# Altium project BALANCE.PrjPcb
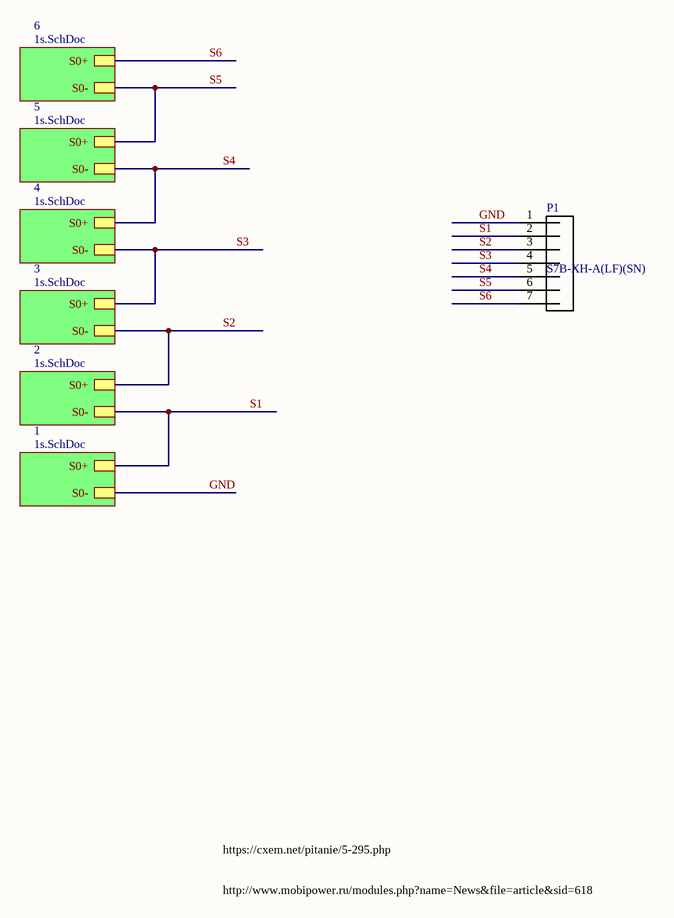
[diagram p0: Sheet2.SchDoc]
2 sheets, 61 parts. Net scope: hierarchical (ports join the sheet entries above them; power ports are global).
Board file: balance.PcbDoc
Sheets:
  Sheet2.SchDoc
    1 = 1s.SchDoc
    2 = 1s.SchDoc
    3 = 1s.SchDoc
    4 = 1s.SchDoc
    5 = 1s.SchDoc
    6 = 1s.SchDoc

## Sheet Sheet2.SchDoc
size A3 portrait

### Parts
P1  S7B-XH-A(LF)(SN)  [*JST_S7B-XH-A(LF)(SN)]

### Sub-sheets
1 = 1s.SchDoc: S0-, S0+
2 = 1s.SchDoc: S0-, S0+
3 = 1s.SchDoc: S0-, S0+
4 = 1s.SchDoc: S0-, S0+
5 = 1s.SchDoc: S0-, S0+
6 = 1s.SchDoc: S0-, S0+

### Nets
GND: P1.1 ; sheet 1/S0-
S1: P1.2 ; sheet 1/S0+, sheet 2/S0-
S2: P1.3 ; sheet 2/S0+, sheet 3/S0-
S3: P1.4 ; sheet 3/S0+, sheet 4/S0-
S4: P1.5 ; sheet 4/S0+, sheet 5/S0-
S5: P1.6 ; sheet 5/S0+, sheet 6/S0-
S6: P1.7 ; sheet 6/S0+

### Notes on the sheet
- https://cxem.net/pitanie/5-295.php
- http://www.mobipower.ru/modules.php?name=News&file=article&sid=618
- Title
- Size:
- Date:
- A3
- Number:
- Time:
- Revision:
- Sheet
- of
- File:

### Library data of the parts
P1 = S7B-XH-A(LF)(SN): XH Series 7 Position 2.5 mm Through Hole Right Angle Press Fit Shrouded Header; MP: S4B-XH-A_LF__SN_; MF: JST Sales; Package: None; SnapEDA_Link: https://www.snapeda.com/parts/S4B-XH-A%28LF%29%28SN%29/JST%20Sales%20America%20Inc./view-part/?ref=snap; Availability: Unavailable; Price: None; Value: *

## Sheet 1s.SchDoc
size A3 portrait
Used 6 times, as channels 1, 2, 3, 4, 5, 6. Parts and nets are listed once, with the designators drawn on the sheet.
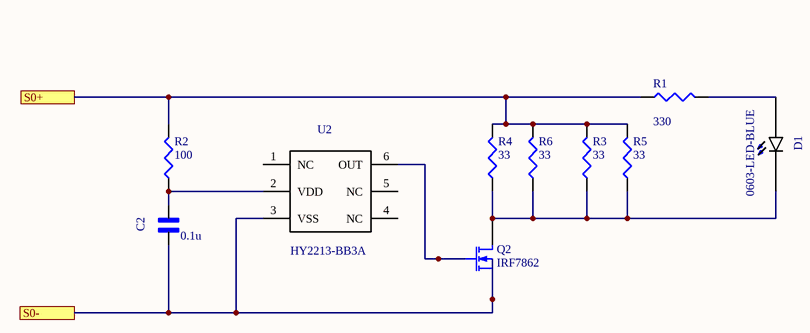
[diagram p1: 1s.SchDoc]

### Parts
C2  value 0.1u  [*CAPC1608X90]  (hidden comment: GX035C104MAT2-500)
D1  0603-LED-BLUE  [*LEDM1608X80_LTE-C1906R-14(Primary)]
Q2  IRF7862  [*SO-08]
R1  value 330  [J1-0603]  (hidden comment: RC0603FR-07330RL)
R2  value 100  [J1-0603]  (hidden comment: Res3)
R3  value 33  [12Z-2010]  (hidden comment: Res3)
R4  value 33  [12Z-2010]  (hidden comment: Res3)
R5  value 33  [12Z-2010]  (hidden comment: Res3)
R6  value 33  [12Z-2010]  (hidden comment: Res3)
U2  HY2213-BB3A  [sot23-6]

### Ports
S0+, S0-

### Nets
S0+: R1.1 R2.2 R3.2 R4.2 R5.2 R6.2 ; port S0+
S0-: C2.2 Q2.S U2.3(VSS) ; port S0-
NetC2_1: C2.1 R2.1 U2.2(VDD)
NetD1_A: D1.A R1.2
NetD1_C: D1.C Q2.D R3.1 R4.1 R5.1 R6.1
NetQ2_G: Q2.G U2.6(OUT)

Not connected (* = marked no-connect by the designer): U2 1(NC) 4(NC) 5(NC)

### Channels
1: designators end in _1; ports S0+=S1 S0-=GND
2: designators end in _2; ports S0+=S2 S0-=S1
3: designators end in _3; ports S0+=S3 S0-=S2
4: designators end in _4; ports S0+=S4 S0-=S3
5: designators end in _5; ports S0+=S5 S0-=S4
6: designators end in _6; ports S0+=S6 S0-=S5

### Notes on the sheet
- Title
- Size:
- Date:
- A3
- Number:
- Time:
- Revision:
- Sheet
- of
- File:

### Library data of the parts
C2 = GX035C104MAT2-500: Cap Thin Film 0.1uf 50v 0603; MF: AVX; MP: GX035C104MAT2-500 or CL10B104JB8NNNC; Pacage Metric: 1608; Type: SMD; Package: 0603 AVX; SnapEDA_Link: https://www.snapeda.com/parts/GX035C104MAT2-500/AVX/view-part/?ref=snap
D1 = LTE-C1906R-14: LED IrLED Chip LED 2-Pin SMD T/R; Package: 0603 Lite-On; MP: 0603-LED-BLUE; SnapEDA_Link: https://www.snapeda.com/parts/LTE-C1906R-14/Lite-On%20Inc./view-part/?ref=snap; Value: *; Type: SMD
Q2 = IRF7862: N-Channel MOSFET; Published: 8-Jun-2000; LatestRevisionDate: 17-Jul-2002; LatestRevisionNote: Re-released for DXP Platform.; PackageVersion: 1995/1996; PackageReference: E3; Publisher: Altium Limited; PackageDescription: TO, Flat Index; 3 In-Line, Axial Leads; Body Dia. 4.6mm; Lead Dia. 0.5 mm (max)
R1 = RC0603FR-07330RL: 330 Ohms ±1% 0.1W, 1/10W Chip Resistor 0603 (1608 Metric) Thick Film; Pacage Metric: 1608; MF: Yageo or NXP; ChipDip_Link: https://www.chipdip.ru/product0/9000079628; HelpURL: https://www.yageo.com/upload/media/product/productsearch/datasheet/rchip/PYu-RC_Group_51_RoHS_L_10.pdf; Package: R0603; Type: SMD; MP: RC0603FR-07330RL; SnapEDA_Link: https://www.snapeda.com/parts/RC0603FR-07330RL/Yageo/view-part/?ref=search&t=RC0603FR-07330RL
R2-R6 = Res3: Resistor; Published: 8-Jun-2000; LatestRevisionDate: 29-May-2009; LatestRevisionNote: IPC-7351 Footprint Added.; PackageReference: J1-0603; Publisher: Altium Limited; PackageDescription: Chip Resistor
U2 = HY2213-BB3A: MF: infineon; MP: IRS10752LTRPBF; Availability: Unavailable; Package: SOT-23-6; Price: None; SnapEDA_Link: https://www.snapeda.com/parts/IRS10752LTRPBF/Infineon%20Technologies/view-part/?ref=search&t=IRS10752; Value: *; HelpURL: http://www.hycontek.com/wp-content/uploads/DS-HY2213_EN.pdf; ChipDip_Link: http://www.hycontek.com/wp-content/uploads/DS-HY2213_EN.pdf

## Nets that join several sheets
GND: Sheet2 (P1.1), 1 (C2_1.2 Q2_1.S U2_1.3)
S1: Sheet2 (P1.2), 1 (6 pins), 2 (C2_2.2 Q2_2.S U2_2.3)
S2: Sheet2 (P1.3), 2 (6 pins), 3 (C2_3.2 Q2_3.S U2_3.3)
S3: Sheet2 (P1.4), 3 (6 pins), 4 (C2_4.2 Q2_4.S U2_4.3)
S4: Sheet2 (P1.5), 4 (6 pins), 5 (C2_5.2 Q2_5.S U2_5.3)
S5: Sheet2 (P1.6), 5 (6 pins), 6 (C2_6.2 Q2_6.S U2_6.3)
S6: Sheet2 (P1.7), 6 (6 pins)